# EAGLE schematic schematic_March16 (EAGLE 9.3.0)
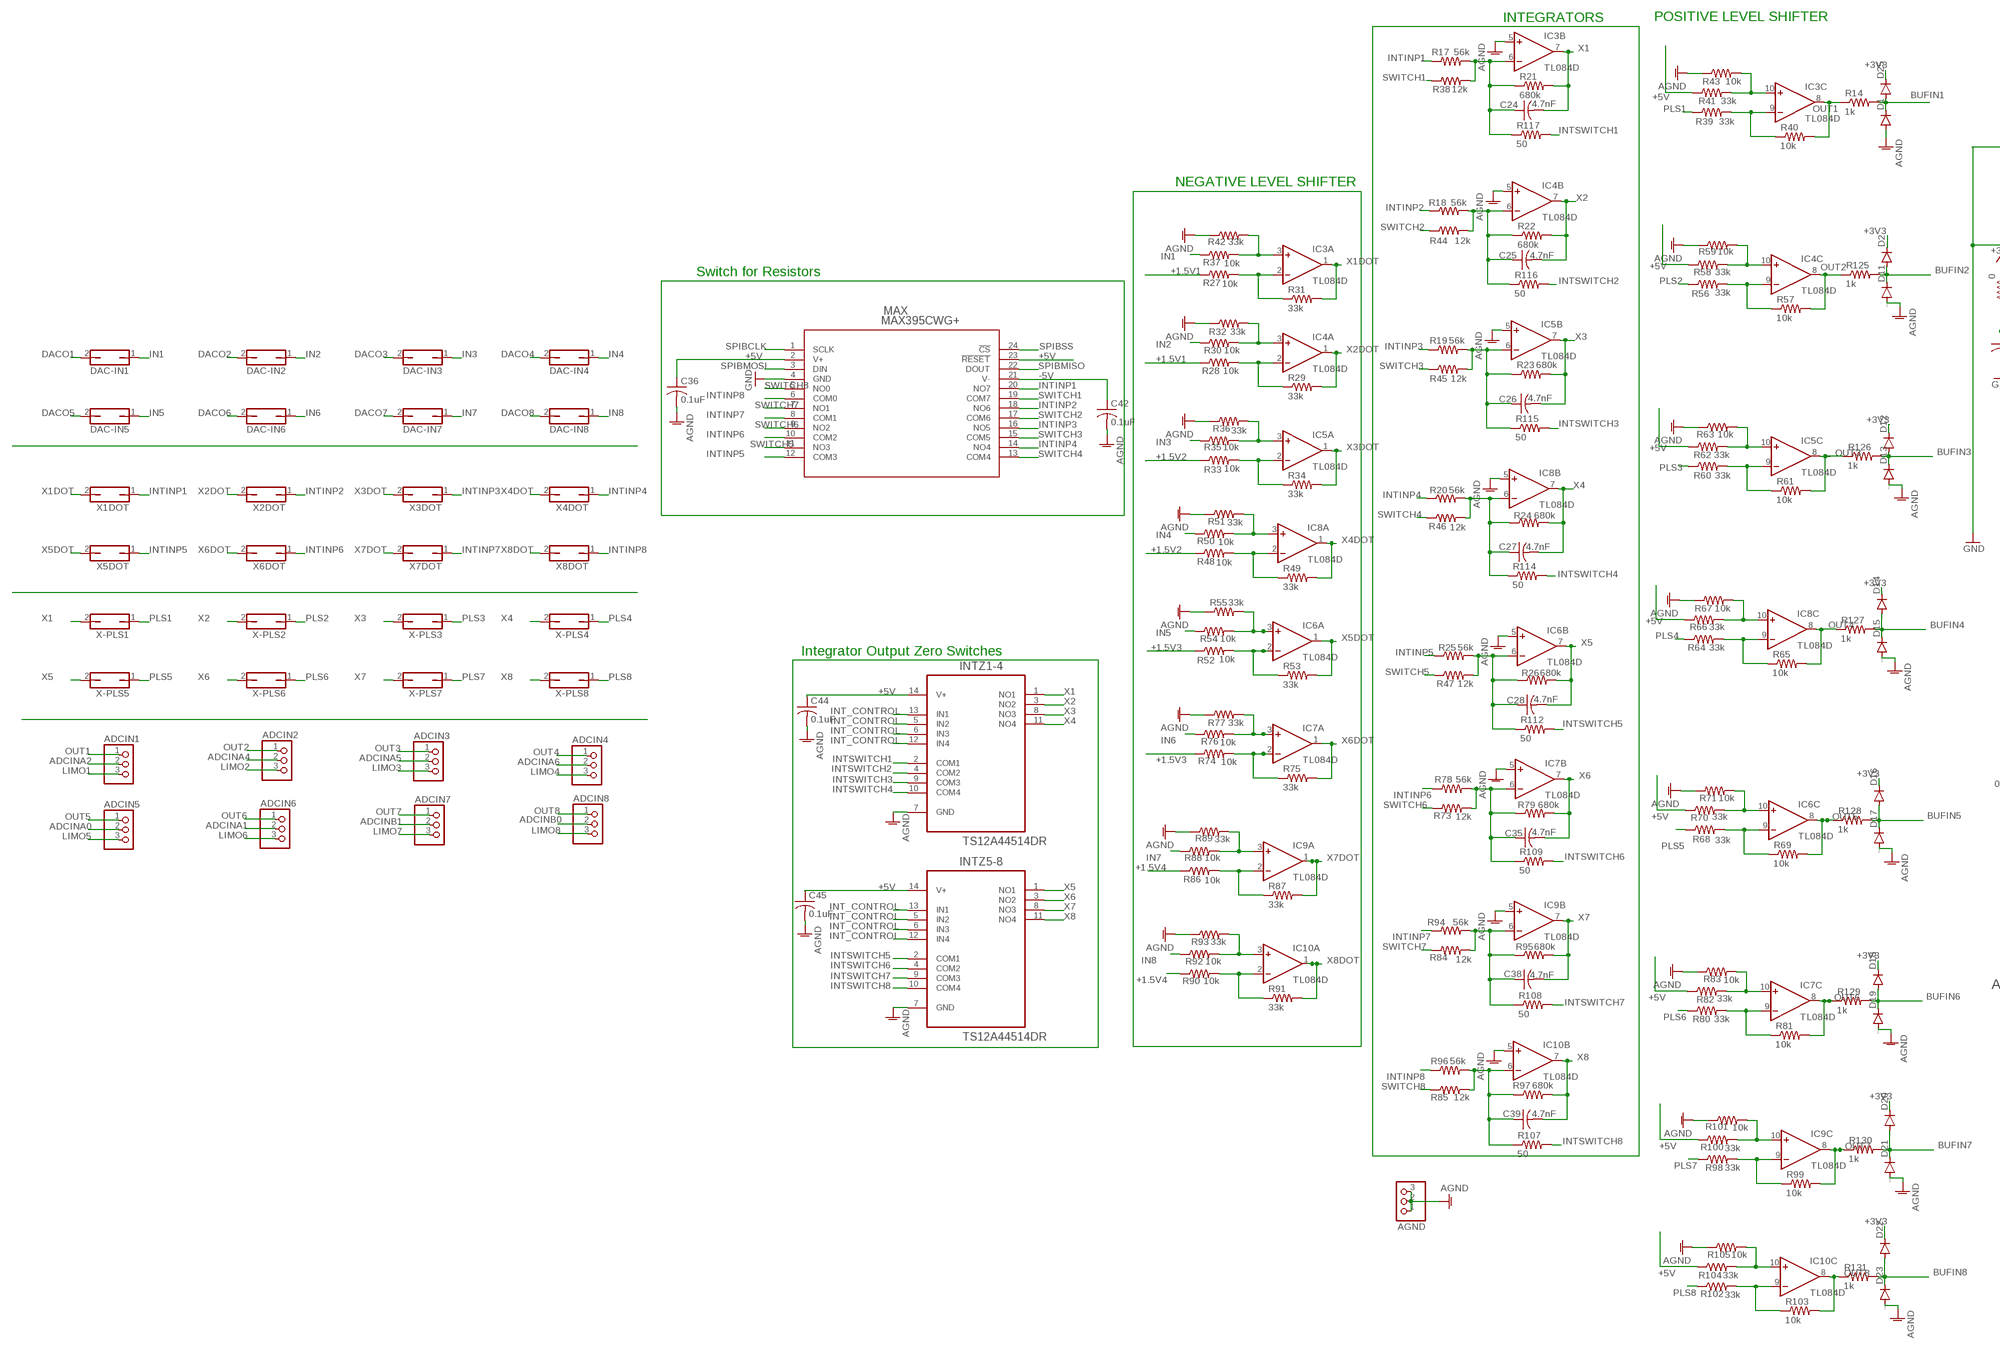
[diagram p0: schematic, sheet 1, part 1 of 2]
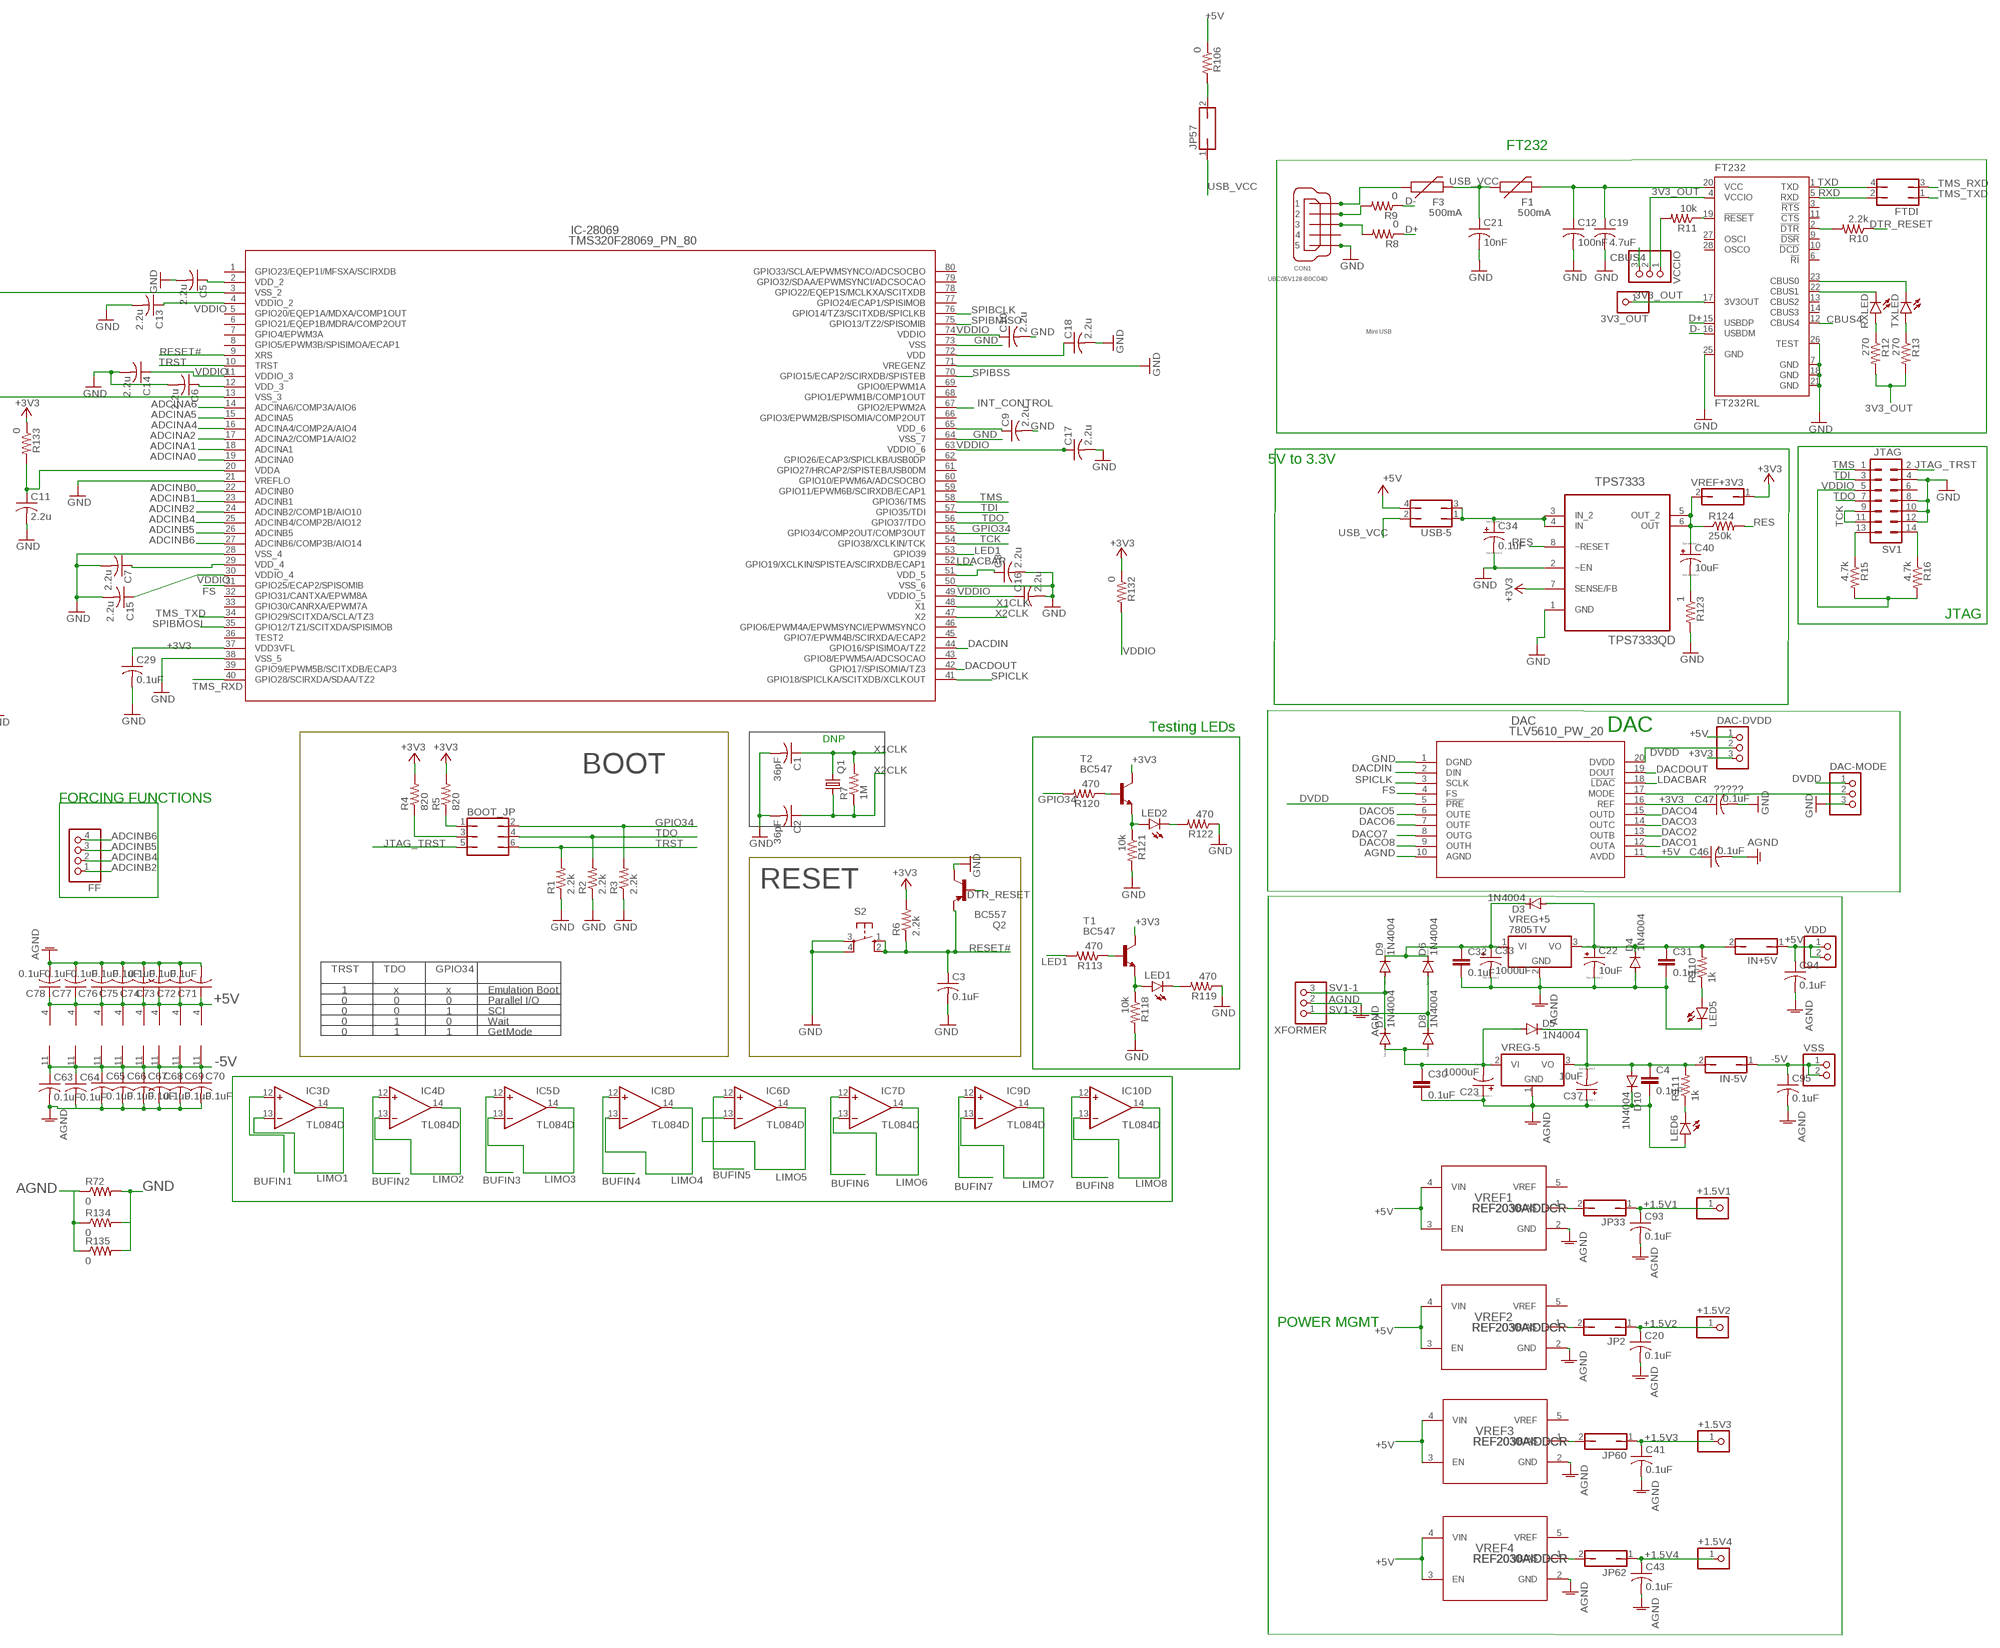
[diagram p1: schematic, sheet 1, part 2 of 2]

## Parts
3V3_OUT  PINHD-1X1  [1X01]
+1.5V1  PINHD-1X1  [1X01]
+1.5V2  PINHD-1X1  [1X01]
+1.5V3  PINHD-1X1  [1X01]
+1.5V4  PINHD-1X1  [1X01]
ADCIN1  PINHD-1X3  [1X03]
ADCIN2  PINHD-1X3  [1X03]
ADCIN3  PINHD-1X3  [1X03]
ADCIN4  PINHD-1X3  [1X03]
ADCIN5  PINHD-1X3  [1X03]
ADCIN6  PINHD-1X3  [1X03]
ADCIN7  PINHD-1X3  [1X03]
ADCIN8  PINHD-1X3  [1X03]
AGND  PINHD-1X3  [1X03]
BOOT_JP  JP3Q  [JP3Q]
C1  36pF  C-USC1206  [C1206]
C2  36pF  C-USC1206  [C1206]
C3  0.1uF  C-USC1206  [C1206]
C4  0.1uF  C-EUC1206  [C1206]
C5  2.2u  C-USC1206  [C1206]
C6  2.2u  C-USC1206  [C1206]
C7  2.2u  C-USC1206  [C1206]
C8  2.2u  C-USC1206  [C1206]
C9  2.2u  C-USC1206  [C1206]
C10  2.2u  C-USC1206  [C1206]
C11  2.2u  C-USC1206  [C1206]
C12  100nF  C-USC1206  [C1206]
C13  2.2u  C-USC1206  [C1206]
C14  2.2u  C-USC1206  [C1206]
C15  2.2u  C-USC1206  [C1206]
C16  2.2u  C-USC1206  [C1206]
C17  2.2u  C-USC1206  [C1206]
C18  2.2u  C-USC1206  [C1206]
C19  4.7uF  C-USC1206  [C1206]
C20  0.1uF  C-USC1206  [C1206]
C21  10nF  C-USC1206  [C1206]
C22  10uF  CPOL-USE2.5-7  [E2,5-7]
C23  1000uF  CPOL-USE2.5-7  [E2,5-7]
C24  4.7nF  C-USC1206  [C1206]
C25  4.7nF  C-USC1206  [C1206]
C26  4.7nF  C-USC1206  [C1206]
C27  4.7nF  C-USC1206  [C1206]
C28  4.7nF  C-USC1206  [C1206]
C29  0.1uF  C-USC1206  [C1206]
C30  0.1uF  C-EUC1206  [C1206]
C31  0.1uF  C-EUC1206  [C1206]
C32  0.1uF  C-EUC1206  [C1206]
C33  1000uF  CPOL-USE2.5-7  [E2,5-7]
C34  0.1uF  CPOL-USE2.5-7  [E2,5-7]
C35  4.7nF  C-USC1206  [C1206]
C36  0.1uF  C-USC1206  [C1206]
C37  10uF  CPOL-USE2.5-7  [E2,5-7]
C38  4.7nF  C-USC1206  [C1206]
C39  4.7nF  C-USC1206  [C1206]
C40  10uF  CPOL-USE2.5-7  [E2,5-7]
C41  0.1uF  C-USC1206  [C1206]
C42  0.1uF  C-USC1206  [C1206]
C43  0.1uF  C-USC1206  [C1206]
C44  0.1uF  C-USC1206  [C1206]
C45  0.1uF  C-USC1206  [C1206]
C46  0.1uF  C-USC1206  [C1206]
C47  0.1uF  C-USC1206  [C1206]
C63  0.1uF  C-USC1206  [C1206]
C64  0.1uF  C-USC1206  [C1206]
C65  0.1uF  C-USC1206  [C1206]
C66  0.1uF  C-USC1206  [C1206]
C67  0.1uF  C-USC1206  [C1206]
C68  0.1uF  C-USC1206  [C1206]
C69  0.1uF  C-USC1206  [C1206]
C70  0.1uF  C-USC1206  [C1206]
C71  0.1uF  C-USC1206  [C1206]
C72  0.1uF  C-USC1206  [C1206]
C73  0.1uF  C-USC1206  [C1206]
C74  0.1uF  C-USC1206  [C1206]
C75  0.1uF  C-USC1206  [C1206]
C76  0.1uF  C-USC1206  [C1206]
C77  0.1uF  C-USC1206  [C1206]
C78  0.1uF  C-USC1206  [C1206]
C93  0.1uF  C-USC1206  [C1206]
C94  0.1uF  C-USC1206  [C1206]
C95  0.1uF  C-USC1206  [C1206]
CON1  UBC05V128-B0C04D  MINI-USB-32005-201  [32005-201]
D1  DIODE-DO214AA  [DO214AA]
D2  DIODE-DO214AA  [DO214AA]
D3  1N4004  [DO41-10]
D4  1N4004  [DO41-10]
D5  1N4004  [DO41-10]
D6  1N4004  [DO41-10]
D7  1N4004  [DO41-10]
D8  1N4004  [DO41-10]
D9  1N4004  [DO41-10]
D10  1N4004  [DO41-10]
D11  DIODE-DO214AA  [DO214AA]
D12  DIODE-DO214AA  [DO214AA]
D13  DIODE-DO214AA  [DO214AA]
D14  DIODE-DO214AA  [DO214AA]
D15  DIODE-DO214AA  [DO214AA]
D16  DIODE-DO214AA  [DO214AA]
D17  DIODE-DO214AA  [DO214AA]
D18  DIODE-DO214AA  [DO214AA]
D19  DIODE-DO214AA  [DO214AA]
D20  DIODE-DO214AA  [DO214AA]
D21  DIODE-DO214AA  [DO214AA]
D22  DIODE-DO214AA  [DO214AA]
D23  DIODE-DO214AA  [DO214AA]
D25  DIODE-DO214AA  [DO214AA]
DAC  TLV5610_PW_20  [PW20]
DAC-DVDD  PINHD-1X3  [1X03]
DAC-IN1  JP1Q  [JP1]
DAC-IN2  JP1Q  [JP1]
DAC-IN3  JP1Q  [JP1]
DAC-IN4  JP1Q  [JP1]
DAC-IN5  JP1Q  [JP1]
DAC-IN6  JP1Q  [JP1]
DAC-IN7  JP1Q  [JP1]
DAC-IN8  JP1Q  [JP1]
DAC-MODE  PINHD-1X3  [1X03]
F1  500mA  PTC0603  [0603]
F3  500mA  PTC0603  [0603]
FF  PINHD-1X4  [1X04]
FT232  FT232RL  [SSOP28]
FTDI  JP2Q  [JP2Q]
IC3  TL084D  [SO14]
IC4  TL084D  [SO14]
IC5  TL084D  [SO14]
IC6  TL084D  [SO14]
IC7  TL084D  [SO14]
IC8  TL084D  [SO14]
IC9  TL084D  [SO14]
IC10  TL084D  [SO14]
IC-28069  TMS320F28069_PN_80  [PN80]
IN+5V  JP1Q  [JP1]
IN-5V  JP1Q  [JP1]
INTZ1-4  TS12A44514DR  [SOIC127P600X175-14N]
INTZ5-8  TS12A44514DR  [SOIC127P600X175-14N]
JP2  JP1Q  [JP1]
JP33  JP1Q  [JP1]
JP57  JP1Q  [JP1]
JP60  JP1Q  [JP1]
JP62  JP1Q  [JP1]
LED1  LEDSML1206  [SML1206]
LED2  LEDSML1206  [SML1206]
LED5  LEDSML1206  [SML1206]
LED6  LEDSML1206  [SML1206]
MAX  MAX395CWG+  [21-0042B_24]
Q1  CRYSTALHC49S  [HC49/S]
Q2  BC557  [TO92-EBC]
R1  2.2k  R-US_R1206  [R1206]
R2  2.2k  R-US_R1206  [R1206]
R3  2.2k  R-US_R1206  [R1206]
R4  820  R-US_R1206  [R1206]
R5  820  R-US_R1206  [R1206]
R6  2.2k  R-US_R1206  [R1206]
R7  1M  R-US_R1206  [R1206]
R8  0  R-US_R1206  [R1206]
R9  0  R-US_R1206  [R1206]
R10  2.2k  R-US_R1206  [R1206]
R11  10k  R-US_R1206  [R1206]
R12  270  R-US_R1206  [R1206]
R13  270  R-US_R1206  [R1206]
R14  1k  R-US_R1206  [R1206]
R15  4.7k  R-US_M1206  [M1206]
R16  4.7k  R-US_M1206  [M1206]
R17  56k  R-US_R1206  [R1206]
R18  56k  R-US_R1206  [R1206]
R19  56k  R-US_R1206  [R1206]
R20  56k  R-US_R1206  [R1206]
R21  680k  R-US_R1206  [R1206]
R22  680k  R-US_R1206  [R1206]
R23  680k  R-US_R1206  [R1206]
R24  680k  R-US_R1206  [R1206]
R25  56k  R-US_R1206  [R1206]
R26  680k  R-US_R1206  [R1206]
R27  10k  R-US_R1206  [R1206]
R28  10k  R-US_R1206  [R1206]
R29  33k  R-US_R1206  [R1206]
R30  10k  R-US_R1206  [R1206]
R31  33k  R-US_R1206  [R1206]
R32  33k  R-US_R1206  [R1206]
R33  10k  R-US_R1206  [R1206]
R34  33k  R-US_R1206  [R1206]
R35  10k  R-US_R1206  [R1206]
R36  33k  R-US_R1206  [R1206]
R37  10k  R-US_R1206  [R1206]
R38  12k  R-US_R1206  [R1206]
R39  33k  R-US_R1206  [R1206]
R40  10k  R-US_R1206  [R1206]
R41  33k  R-US_R1206  [R1206]
R42  33k  R-US_R1206  [R1206]
R43  10k  R-US_R1206  [R1206]
R44  12k  R-US_R1206  [R1206]
R45  12k  R-US_R1206  [R1206]
R46  12k  R-US_R1206  [R1206]
R47  12k  R-US_R1206  [R1206]
R48  10k  R-US_R1206  [R1206]
R49  33k  R-US_R1206  [R1206]
R50  10k  R-US_R1206  [R1206]
R51  33k  R-US_R1206  [R1206]
R52  10k  R-US_R1206  [R1206]
R53  33k  R-US_R1206  [R1206]
R54  10k  R-US_R1206  [R1206]
R55  33k  R-US_R1206  [R1206]
R56  33k  R-US_R1206  [R1206]
R57  10k  R-US_R1206  [R1206]
R58  33k  R-US_R1206  [R1206]
R59  10k  R-US_R1206  [R1206]
R60  33k  R-US_R1206  [R1206]
R61  10k  R-US_R1206  [R1206]
R62  33k  R-US_R1206  [R1206]
R63  10k  R-US_R1206  [R1206]
R64  33k  R-US_R1206  [R1206]
R65  10k  R-US_R1206  [R1206]
R66  33k  R-US_R1206  [R1206]
R67  10k  R-US_R1206  [R1206]
R68  33k  R-US_R1206  [R1206]
R69  10k  R-US_R1206  [R1206]
R70  33k  R-US_R1206  [R1206]
R71  10k  R-US_R1206  [R1206]
R72  0  R-US_R1206  [R1206]
R73  12k  R-US_R1206  [R1206]
R74  10k  R-US_R1206  [R1206]
R75  33k  R-US_R1206  [R1206]
R76  10k  R-US_R1206  [R1206]
R77  33k  R-US_R1206  [R1206]
R78  56k  R-US_R1206  [R1206]
R79  680k  R-US_R1206  [R1206]
R80  33k  R-US_R1206  [R1206]
R81  10k  R-US_R1206  [R1206]
R82  33k  R-US_R1206  [R1206]
R83  10k  R-US_R1206  [R1206]
R84  12k  R-US_R1206  [R1206]
R85  12k  R-US_R1206  [R1206]
R86  10k  R-US_R1206  [R1206]
R87  33k  R-US_R1206  [R1206]
R88  10k  R-US_R1206  [R1206]
R89  33k  R-US_R1206  [R1206]
R90  10k  R-US_R1206  [R1206]
R91  33k  R-US_R1206  [R1206]
R92  10k  R-US_R1206  [R1206]
R93  33k  R-US_R1206  [R1206]
R94  56k  R-US_R1206  [R1206]
R95  680k  R-US_R1206  [R1206]
R96  56k  R-US_R1206  [R1206]
R97  680k  R-US_R1206  [R1206]
R98  33k  R-US_R1206  [R1206]
R99  10k  R-US_R1206  [R1206]
R100  33k  R-US_R1206  [R1206]
R101  10k  R-US_R1206  [R1206]
R102  33k  R-US_R1206  [R1206]
R103  10k  R-US_R1206  [R1206]
R104  33k  R-US_R1206  [R1206]
R105  10k  R-US_R1206  [R1206]
R106  0  R-US_R1206  [R1206]
R107  50  R-US_R1206  [R1206]
R108  50  R-US_R1206  [R1206]
R109  50  R-US_R1206  [R1206]
R110  1k  R-US_0207/10  [0207/10]
R111  1k  R-US_0207/10  [0207/10]
R112  50  R-US_R1206  [R1206]
R113  470  R-US_R1206  [R1206]
R114  50  R-US_R1206  [R1206]
R115  50  R-US_R1206  [R1206]
R116  50  R-US_R1206  [R1206]
R117  50  R-US_R1206  [R1206]
R118  10k  R-US_R1206  [R1206]
R119  470  R-US_R1206  [R1206]
R120  470  R-US_R1206  [R1206]
R121  10k  R-US_R1206  [R1206]
R122  470  R-US_R1206  [R1206]
R123  1  R-US_M1206  [M1206]
R124  250k  R-US_M1206  [M1206]
R125  1k  R-US_R1206  [R1206]
R126  1k  R-US_R1206  [R1206]
R127  1k  R-US_R1206  [R1206]
R128  1k  R-US_R1206  [R1206]
R129  1k  R-US_R1206  [R1206]
R130  1k  R-US_R1206  [R1206]
R131  1k  R-US_R1206  [R1206]
R132  0  R-US_R1206  [R1206]
R133  0  R-US_R1206  [R1206]
R134  0  R-US_R1206  [R1206]
R135  0  R-US_R1206  [R1206]
RXLED  LEDSML1206  [SML1206]
S2  10-XX  [B3F-10XX]
SV1  JTAG  MA07-2  [MA07-2]
T1  BC547  [TO92]
T2  BC547  [TO92]
TPS7333  TPS7333QD  [SOIC127P600X175-8N]
TXLED  LEDSML1206  [SML1206]
USB-5  JP2Q  [JP2Q]
VCCIO  PINHD-1X3  [1X03]
VDD  PINHD-1X2  [1X02]
VREF1  REF2030AIDDCR  [DDC0005A_N]
VREF2  REF2030AIDDCR  [DDC0005A_N]
VREF3  REF2030AIDDCR  [DDC0005A_N]
VREF4  REF2030AIDDCR  [DDC0005A_N]
VREF+3V3  JP1Q  [JP1]
VREG+5  7805TV  [TO220V]
VREG-5  7905T  [TO220H]
VSS  PINHD-1X2  [1X02]
X1DOT  JP1Q  [JP1]
X2DOT  JP1Q  [JP1]
X3DOT  JP1Q  [JP1]
X4DOT  JP1Q  [JP1]
X5DOT  JP1Q  [JP1]
X6DOT  JP1Q  [JP1]
X7DOT  JP1Q  [JP1]
X8DOT  JP1Q  [JP1]
X-PLS1  JP1Q  [JP1]
X-PLS2  JP1Q  [JP1]
X-PLS3  JP1Q  [JP1]
X-PLS4  JP1Q  [JP1]
X-PLS5  JP1Q  [JP1]
X-PLS6  JP1Q  [JP1]
X-PLS7  JP1Q  [JP1]
X-PLS8  JP1Q  [JP1]
XFORMER  PINHD-1X3  [1X03]

## Nets
3V3_OUT: 3V3_OUT.1 FT232.4(VCCIO) FT232.17(3V3OUT) R12.2 R13.2 VCCIO.2
+1.5V1: +1.5V1.1 C93.1 JP33.1 R27.1 R28.1
+1.5V2: +1.5V2.1 C20.1 JP2.1 R33.1 R48.1
+1.5V3: +1.5V3.1 C41.1 JP60.1 R52.1 R74.1
+1.5V4: +1.5V4.1 C43.1 JP62.1 R86.1 R90.1
+3V3: C29.1 C47.1 D2.C D12.C D14.C D16.C D18.C D20.C D22.C D25.C DAC-DVDD.3 DAC.16(REF) IC-28069.37(VDD3VFL) R4.2 R5.2 R6.2 R132.1 R133.1 T1.3(C) T2.3(C) TPS7333.7(SENSE/FB) VREF+3V3.1
+5V: C36.1 C44.1 C45.1 C46.1 C71.1 C72.1 C73.1 C74.1 C75.1 C76.1 C77.1 C78.1 C94.1 DAC-DVDD.1 DAC.11(AVDD) IC3.4(P:V+) IC4.4(P:V+) IC5.4(P:V+) IC6.4(P:V+) IC7.4(P:V+) IC8.4(P:V+) IC9.4(P:V+) IC10.4(P:V+) IN+5V.1 INTZ1-4.14(V+) INTZ5-8.14(V+) MAX.2(V+) MAX.23(!RESET) R41.1 R58.1 R62.1 R66.1 R70.1 R82.1 R100.1 R104.1 R106.1 USB-5.4 VDD.1 VDD.2 VREF1.3(EN) VREF1.4(VIN) VREF2.3(EN) VREF2.4(VIN) VREF3.3(EN) VREF3.4(VIN) VREF4.3(EN) VREF4.4(VIN) ; supply symbol labelled +3V3
-5V: C42.1 C63.1 C64.1 C65.1 C66.1 C67.1 C68.1 C69.1 C70.1 C95.1 IC3.11(P:V-) IC4.11(P:V-) IC5.11(P:V-) IC6.11(P:V-) IC7.11(P:V-) IC8.11(P:V-) IC9.11(P:V-) IC10.11(P:V-) IN-5V.1 MAX.21(V-) VSS.1 VSS.2
?????: DAC-MODE.2 DAC.17(MODE)
ADCINA0: ADCIN5.2 IC-28069.19(ADCINA0)
ADCINA1: ADCIN6.2 IC-28069.18(ADCINA1)
ADCINA2: ADCIN1.2 IC-28069.17(ADCINA2/COMP1A/AIO2)
ADCINA4: ADCIN2.2 IC-28069.16(ADCINA4/COMP2A/AIO4)
ADCINA5: ADCIN3.2 IC-28069.15(ADCINA5)
ADCINA6: ADCIN4.2 IC-28069.14(ADCINA6/COMP3A/AIO6)
ADCINB0: ADCIN8.2 IC-28069.22(ADCINB0)
ADCINB1: ADCIN7.2 IC-28069.23(ADCINB1)
ADCINB2: FF.1 IC-28069.24(ADCINB2/COMP1B/AIO10)
ADCINB4: FF.2 IC-28069.25(ADCINB4/COMP2B/AIO12)
ADCINB5: FF.3 IC-28069.26(ADCINB5)
ADCINB6: FF.4 IC-28069.27(ADCINB6/COMP3B/AIO14)
AGND: AGND.1 AGND.2 AGND.3 C4.2 C20.2 C22.- C23.+ C30.2 C31.2 C32.2 C33.- C36.2 C37.+ C41.2 C42.2 C43.2 C44.2 C45.2 C46.2 C63.2 C64.2 C65.2 C66.2 C67.2 C68.2 C69.2 C70.2 C71.2 C72.2 C73.2 C74.2 C75.2 C76.2 C77.2 C78.2 C93.2 C94.2 C95.2 D1.A D4.A D10.C D11.A D13.A D15.A D17.A D19.A D21.A D23.A DAC.10(AGND) IC3.5(B:+IN) IC4.5(B:+IN) IC5.5(B:+IN) IC6.5(B:+IN) IC7.5(B:+IN) IC8.5(B:+IN) IC9.5(B:+IN) IC10.5(B:+IN) INTZ1-4.7(GND) INTZ5-8.7(GND) LED5.C LED6.A R32.1 R36.1 R42.1 R43.1 R51.1 R55.1 R59.1 R63.1 R67.1 R71.1 R72.1 R77.1 R83.1 R89.1 R93.1 R101.1 R105.1 R134.1 R135.1 VREF1.2(GND) VREF2.2(GND) VREF3.2(GND) VREF4.2(GND) VREG+5.2(GND) VREG-5.1(GND) XFORMER.2
BUFIN1: D1.C D25.A IC3.12(D:+IN) R14.2
BUFIN2: D2.A D11.C IC4.12(D:+IN) R125.2
BUFIN3: D12.A D13.C IC5.12(D:+IN) R126.2
BUFIN4: D14.A D15.C IC8.12(D:+IN) R127.2
BUFIN5: D16.A D17.C IC6.12(D:+IN) R128.2
BUFIN6: D18.A D19.C IC7.12(D:+IN) R129.2
BUFIN7: D20.A D21.C IC9.12(D:+IN) R130.2
BUFIN8: D22.A D23.C IC10.12(D:+IN) R131.2
CBUS4: FT232.12(CBUS4) VCCIO.3
D+: FT232.15(USBDP) R8.1
D-: FT232.16(USBDM) R9.1
DACDIN: DAC.2(DIN) IC-28069.44(GPIO16/SPISIMOA/TZ2)
DACDOUT: DAC.19(DOUT) IC-28069.42(GPIO17/SPISOMIA/TZ3)
DACO1: DAC-IN1.2 DAC.12(OUTA)
DACO2: DAC-IN2.2 DAC.13(OUTB)
DACO3: DAC-IN3.2 DAC.14(OUTC)
DACO4: DAC-IN4.2 DAC.15(OUTD)
DACO5: DAC-IN5.2 DAC.6(OUTE)
DACO6: DAC-IN6.2 DAC.7(OUTF)
DACO7: DAC-IN7.2 DAC.8(OUTG)
DACO8: DAC-IN8.2 DAC.9(OUTH)
DTR_RESET: Q2.B R10.1
DVDD: DAC-DVDD.2 DAC-MODE.1 DAC.5(!PRE) DAC.20(DVDD)
FS: DAC.4(FS) IC-28069.31(GPIO25/ECAP2/SPISOMIB)
GND: C1.2 C2.2 C3.2 C5.2 C6.2 C7.2 C8.2 C9.2 C10.2 C11.2 C12.2 C13.2 C14.2 C15.2 C16.2 C17.2 C18.2 C19.2 C21.2 C29.2 C34.- C47.2 CON1.5 DAC-MODE.3 DAC.1(DGND) FT232.7(GND) FT232.18(GND) FT232.21(GND) FT232.25(GND) FT232.26(TEST) IC-28069.3(VSS_2) IC-28069.13(VSS_3) IC-28069.21(VREFLO) IC-28069.28(VSS_4) IC-28069.38(VSS_5) IC-28069.50(VSS_6) IC-28069.64(VSS_7) IC-28069.71(VREGENZ) IC-28069.73(VSS) MAX.4(GND) Q2.C R1.1 R2.1 R3.1 R72.2 R118.2 R119.1 R121.2 R122.1 R123.2 R134.2 R135.2 S2.3(P) S2.4(P1) SV1.4 SV1.8 SV1.10 SV1.12 TPS7333.1(GND) TPS7333.2(~EN)
GPIO34: BOOT_JP.2 IC-28069.55(GPIO34/COMP2OUT/COMP3OUT) R3.2 R120.2
IDK: C22.+ C31.1 D3.A D4.C IN+5V.2 R110.2 VREG+5.3(VO)
IDK2: C4.1 C37.- D5.C D10.A IN-5V.2 R111.2 VREG-5.3(VO)
IN1: DAC-IN1.1 R37.1
IN2: DAC-IN2.1 R30.1
IN3: DAC-IN3.1 R35.1
IN4: DAC-IN4.1 R50.1
IN5: DAC-IN5.1 R54.1
IN6: DAC-IN6.1 R76.1
IN7: DAC-IN7.1 R88.1
IN8: DAC-IN8.1 R92.1
INT_CONTROL: IC-28069.67(GPIO2/EPWM2A) INTZ1-4.5(IN2) INTZ1-4.6(IN3) INTZ1-4.12(IN4) INTZ1-4.13(IN1) INTZ5-8.5(IN2) INTZ5-8.6(IN3) INTZ5-8.12(IN4) INTZ5-8.13(IN1)
INTINP1: MAX.20(NO7) R17.1 X1DOT.1
INTINP2: MAX.18(NO6) R18.1 X2DOT.1
INTINP3: MAX.16(NO5) R19.1 X3DOT.1
INTINP4: MAX.14(NO4) R20.1 X4DOT.1
INTINP5: MAX.12(COM3) R25.1 X5DOT.1
INTINP6: MAX.10(COM2) R78.1 X6DOT.1
INTINP7: MAX.8(COM1) R94.1 X7DOT.1
INTINP8: MAX.6(COM0) R96.1 X8DOT.1
INTSWITCH1: INTZ1-4.2(COM1) R117.2
INTSWITCH2: INTZ1-4.4(COM2) R116.2
INTSWITCH3: INTZ1-4.9(COM3) R115.2
INTSWITCH4: INTZ1-4.10(COM4) R114.2
INTSWITCH5: INTZ5-8.2(COM1) R112.2
INTSWITCH6: INTZ5-8.4(COM2) R109.2
INTSWITCH7: INTZ5-8.9(COM3) R108.2
INTSWITCH8: INTZ5-8.10(COM4) R107.2
JTAG_TRST: BOOT_JP.5 SV1.2
LDACBAR: DAC.18(!LDAC) IC-28069.52(GPIO19/XCLKIN/SPISTEA/SCIRXDB/ECAP1)
LED1: IC-28069.53(GPIO39) R113.2
LIMO1: ADCIN1.3 IC3.13(D:-IN) IC3.14(D:OUT)
LIMO2: ADCIN2.3 IC4.13(D:-IN) IC4.14(D:OUT)
LIMO3: ADCIN3.3 IC5.13(D:-IN) IC5.14(D:OUT)
LIMO4: ADCIN4.3 IC8.13(D:-IN) IC8.14(D:OUT)
LIMO5: ADCIN5.3 IC6.13(D:-IN) IC6.14(D:OUT)
LIMO6: ADCIN6.3 IC7.13(D:-IN) IC7.14(D:OUT)
LIMO7: ADCIN7.3 IC9.13(D:-IN) IC9.14(D:OUT)
LIMO8: ADCIN8.3 IC10.13(D:-IN) IC10.14(D:OUT)
N$1: C5.1 IC-28069.2(VDD_2)
N$2: C6.1 IC-28069.12(VDD_3)
N$3: C7.1 IC-28069.29(VDD_4)
N$4: C8.1 IC-28069.51(VDD_5)
N$5: C9.1 IC-28069.65(VDD_6)
N$6: FT232.2(!DTR) R10.2
N$7: C11.1 IC-28069.20(VDDA) R133.2
N$8: C18.1 IC-28069.72(VDD)
N$9: BOOT_JP.1 R5.1
N$10: BOOT_JP.3 R4.1
N$11: CON1.2 R9.2
N$12: CON1.3 R8.2
N$13: FT232.19(!RESET) R11.1
N$14: FT232.22(CBUS1) RXLED.C
N$15: FT232.23(CBUS0) TXLED.C
N$16: R12.1 RXLED.A
N$17: R13.1 TXLED.A
N$20: C25.1 IC4.6(B:-IN) R18.2 R22.1 R44.2 R116.1
N$21: C26.1 IC5.6(B:-IN) R19.2 R23.1 R45.2 R115.1
N$22: C27.1 IC8.6(B:-IN) R20.2 R24.1 R46.2 R114.1
N$23: IC4.2(A:-IN) R28.2 R29.1
N$24: R15.1 SV1.13
N$25: R16.1 SV1.14
N$26: IC4.3(A:+IN) R30.2 R32.2
N$28: C24.1 IC3.6(B:-IN) R17.2 R21.1 R38.2 R117.1
N$29: IC3.2(A:-IN) R27.2 R31.1
N$30: C28.1 IC6.6(B:-IN) R25.2 R26.1 R47.2 R112.1
N$31: IC5.2(A:-IN) R33.2 R34.1
N$33: IC3.3(A:+IN) R37.2 R42.2
N$35: IC5.3(A:+IN) R35.2 R36.2
N$36: IC3.9(C:-IN) R39.2 R40.1
N$38: IC3.10(C:+IN) R41.2 R43.2
N$39: IC8.2(A:-IN) R48.2 R49.1
N$40: IC8.3(A:+IN) R50.2 R51.2
N$41: IC7.2(A:-IN) R74.2 R75.1
N$42: IC6.2(A:-IN) R52.2 R53.1
N$44: IC6.3(A:+IN) R54.2 R55.2
N$45: IC7.3(A:+IN) R76.2 R77.2
N$47: IC4.9(C:-IN) R56.2 R57.1
N$48: IC4.10(C:+IN) R58.2 R59.2
N$49: IC5.9(C:-IN) R60.2 R61.1
N$50: IC5.10(C:+IN) R62.2 R63.2
N$51: IC8.9(C:-IN) R64.2 R65.1
N$52: IC8.10(C:+IN) R66.2 R67.2
N$53: IC6.9(C:-IN) R68.2 R69.1
N$54: IC6.10(C:+IN) R70.2 R71.2
N$55: C35.1 IC7.6(B:-IN) R73.2 R78.2 R79.1 R109.1
N$56: IC7.9(C:-IN) R80.2 R81.1
N$57: IC7.10(C:+IN) R82.2 R83.2
N$58: IC9.2(A:-IN) R86.2 R87.1
N$59: IC9.3(A:+IN) R88.2 R89.2
N$60: IC10.2(A:-IN) R90.2 R91.1
N$61: IC10.3(A:+IN) R92.2 R93.2
N$62: C38.1 IC9.6(B:-IN) R84.2 R94.2 R95.1 R108.1
N$63: C39.1 IC10.6(B:-IN) R85.2 R96.2 R97.1 R107.1
N$64: IC9.9(C:-IN) R98.2 R99.1
N$65: IC9.10(C:+IN) R100.2 R101.2
N$66: IC10.9(C:-IN) R102.2 R103.1
N$67: IC10.10(C:+IN) R104.2 R105.2
N$73: C32.1 C33.+ D3.C D6.C D9.C VREG+5.1(VI)
N$77: C40.+ R124.1 TPS7333.5(OUT_2) TPS7333.6(OUT) VREF+3V3.2
N$78: C40.- R123.1
N$80: LED6.C R111.1
N$81: C34.+ TPS7333.3(IN_2) TPS7333.4(IN) USB-5.1 USB-5.3
N$82: LED5.A R110.1
N$83: CON1.1 F3.1
N$86: C23.- C30.1 D5.A D7.A D8.A VREG-5.2(VI)
N$91: JP33.2 VREF1.1(VBIAS)
N$95: R11.2 VCCIO.1
N$102: R113.1 T1.2(B)
N$104: LED1.A R118.1 T1.1(E)
N$105: LED1.C R119.2
N$106: R120.1 T2.2(B)
N$107: LED2.A R121.1 T2.1(E)
N$108: LED2.C R122.2
N$132: JP2.2 VREF2.1(VBIAS)
N$134: JP57.2 R106.2
N$135: JP60.2 VREF3.1(VBIAS)
N$136: JP62.2 VREF4.1(VBIAS)
OUT1: ADCIN1.1 IC3.8(C:OUT) R14.1 R40.2
OUT2: ADCIN2.1 IC4.8(C:OUT) R57.2 R125.1
OUT3: ADCIN3.1 IC5.8(C:OUT) R61.2 R126.1
OUT4: ADCIN4.1 IC8.8(C:OUT) R65.2 R127.1
OUT5: ADCIN5.1 IC6.8(C:OUT) R69.2 R128.1
OUT6: ADCIN6.1 IC7.8(C:OUT) R81.2 R129.1
OUT7: ADCIN7.1 IC9.8(C:OUT) R99.2 R130.1
OUT8: ADCIN8.1 IC10.8(C:OUT) R103.2 R131.1
PLS1: R39.1 X-PLS1.1
PLS2: R56.1 X-PLS2.1
PLS3: R60.1 X-PLS3.1
PLS4: R64.1 X-PLS4.1
PLS5: R68.1 X-PLS5.1
PLS6: R80.1 X-PLS6.1
PLS7: R98.1 X-PLS7.1
PLS8: R102.1 X-PLS8.1
RES: R124.2 TPS7333.8(~RESET)
RESET#: C3.1 IC-28069.9(XRS) Q2.E R6.1 S2.1(S) S2.2(S1)
RXD: FT232.5(RXD) FTDI.2
SPIBCLK: IC-28069.76(GPIO14/TZ3/SCITXDB/SPICLKB) MAX.1(SCLK)
SPIBMISO: IC-28069.75(GPIO13/TZ2/SPISOMIB) MAX.22(DOUT)
SPIBMOSI: IC-28069.35(GPIO12/TZ1/SCITXDA/SPISIMOB) MAX.3(DIN)
SPIBSS: IC-28069.70(GPIO15/ECAP2/SCIRXDB/SPISTEB) MAX.24(!CS)
SPICLK: DAC.3(SCLK) IC-28069.41(GPIO18/SPICLKA/SCITXDB/XCLKOUT)
SV1-1: D7.C D9.A XFORMER.3
SV1-3: D6.A D8.C XFORMER.1
SWITCH1: MAX.19(COM7) R38.1
SWITCH2: MAX.17(COM6) R44.1
SWITCH3: MAX.15(COM5) R45.1
SWITCH4: MAX.13(COM4) R46.1
SWITCH5: MAX.11(NO3) R47.1
SWITCH6: MAX.9(NO2) R73.1
SWITCH7: MAX.7(NO1) R84.1
SWITCH8: MAX.5(NO0) R85.1
TCK: IC-28069.54(GPIO38/XCLKIN/TCK) SV1.9 SV1.11
TDI: IC-28069.57(GPIO35/TDI) SV1.3
TDO: BOOT_JP.4 IC-28069.56(GPIO37/TDO) R2.2 SV1.7
TMS: IC-28069.58(GPIO36/TMS) SV1.1
TMS_RXD: FTDI.3 IC-28069.40(GPIO28/SCIRXDA/SDAA/TZ2)
TMS_TXD: FTDI.1 IC-28069.34(GPIO29/SCITXDA/SCLA/TZ3)
TRST: BOOT_JP.6 IC-28069.10(TRST) R1.2
TXD: FT232.1(TXD) FTDI.4
USB_VCC: C21.1 F1.1 F3.2 JP57.1 USB-5.2
VCC [power]: C12.1 C19.1 F1.2 FT232.20(VCC)
VDDIO: C10.1 C13.1 C14.1 C15.1 C16.1 C17.1 IC-28069.4(VDDIO_2) IC-28069.11(VDDIO_3) IC-28069.30(VDDIO_4) IC-28069.49(VDDIO_5) IC-28069.63(VDDIO_6) IC-28069.74(VDDIO) R15.2 R16.2 R132.2 SV1.5
X1: C24.2 IC3.7(B:OUT) INTZ1-4.1(NO1) R21.2 X-PLS1.2
X1CLK: C1.1 IC-28069.48(X1) Q1.2 R7.2
X1DOT: IC3.1(A:OUT) R31.2 X1DOT.2
X2: C25.2 IC4.7(B:OUT) INTZ1-4.3(NO2) R22.2 X-PLS2.2
X2CLK: C2.1 IC-28069.47(X2) Q1.1 R7.1
X2DOT: IC4.1(A:OUT) R29.2 X2DOT.2
X3: C26.2 IC5.7(B:OUT) INTZ1-4.8(NO3) R23.2 X-PLS3.2
X3DOT: IC5.1(A:OUT) R34.2 X3DOT.2
X4: C27.2 IC8.7(B:OUT) INTZ1-4.11(NO4) R24.2 X-PLS4.2
X4DOT: IC8.1(A:OUT) R49.2 X4DOT.2
X5: C28.2 IC6.7(B:OUT) INTZ5-8.1(NO1) R26.2 X-PLS5.2
X5DOT: IC6.1(A:OUT) R53.2 X5DOT.2
X6: C35.2 IC7.7(B:OUT) INTZ5-8.3(NO2) R79.2 X-PLS6.2
X6DOT: IC7.1(A:OUT) R75.2 X6DOT.2
X7: C38.2 IC9.7(B:OUT) INTZ5-8.8(NO3) R95.2 X-PLS7.2
X7DOT: IC9.1(A:OUT) R87.2 X7DOT.2
X8: C39.2 IC10.7(B:OUT) INTZ5-8.11(NO4) R97.2 X-PLS8.2
X8DOT: IC10.1(A:OUT) R91.2 X8DOT.2
Unconnected: CON1.4 FT232.3(!RTS) FT232.6(!RI) FT232.9(!DSR) FT232.10(!DCD) FT232.11(!CTS) FT232.13(CBUS2) FT232.14(CBUS3) FT232.27(OSCI) FT232.28(OSCO) IC-28069.1(GPIO23/EQEP1I/MFSXA/SCIRXDB) IC-28069.5(GPIO20/EQEP1A/MDXA/COMP1OUT) IC-28069.6(GPIO21/EQEP1B/MDRA/COMP2OUT) IC-28069.7(GPIO4/EPWM3A) IC-28069.8(GPIO5/EPWM3B/SPISIMOA/ECAP1) IC-28069.32(GPIO31/CANTXA/EPWM8A) IC-28069.33(GPIO30/CANRXA/EPWM7A) IC-28069.36(TEST2) IC-28069.39(GPIO9/EPWM5B/SCITXDB/ECAP3) IC-28069.43(GPIO8/EPWM5A/ADCSOCAO) IC-28069.45(GPIO7/EPWM4B/SCIRXDA/ECAP2) IC-28069.46(GPIO6/EPWM4A/EPWMSYNCI/EPWMSYNCO) IC-28069.59(GPIO11/EPWM6B/SCIRXDB/ECAP1) IC-28069.60(GPIO10/EPWM6A/ADCSOCBO) IC-28069.61(GPIO27/HRCAP2/SPISTEB/USB0DM) IC-28069.62(GPIO26/ECAP3/SPICLKB/USB0DP) IC-28069.66(GPIO3/EPWM2B/SPISOMIA/COMP2OUT) IC-28069.68(GPIO1/EPWM1B/COMP1OUT) IC-28069.69(GPIO0/EPWM1A) IC-28069.77(GPIO24/ECAP1/SPISIMOB) IC-28069.78(GPIO22/EQEP1S/MCLKXA/SCITXDB) IC-28069.79(GPIO32/SDAA/EPWMSYNCI/ADCSOCAO) IC-28069.80(GPIO33/SCLA/EPWMSYNCO/ADCSOCBO) SV1.6 VREF1.5(VREF) VREF2.5(VREF) VREF3.5(VREF) VREF4.5(VREF)

## Notes on the sheet
- FT232
- INTEGRATORS | POSITIVE LEVEL SHIFTER
- NEGATIVE LEVEL SHIFTER | Mini USB
- Switch for Resistors
- 5V to 3.3V
- JTAG
- Testing LEDs | DAC
- DNP
- BOOT
- FORCING FUNCTIONS
- Integrator Output Zero Switches
- RESET
- TRST | TDO | GPIO34
- 1 | x | x | Emulation Boot
- 0 | 0 | 0 | Parallel I/O
- 0 | 0 | 1 | SCI
- 0 | 1 | 0 | Wait
- 0 | 1 | 1 | GetMode
- POWER MGMT

## Library data of the parts
3V3_OUT +1.5V1-+1.5V4 = pinhead:PINHD-1X1: PIN HEADER
ADCIN1-ADCIN8 AGND DAC-DVDD DAC-MODE VCCIO XFORMER = pinhead:PINHD-1X3: PIN HEADER
BOOT_JP = jumper:JP3Q: JUMPER
C1-C3 C5-C21 C29 C36 C41-C45 C63-C78 C93-C95 = resistor:C-US: CAPACITOR, American symbol
C4 C30-C32 = rcl:C-EU: CAPACITOR, European symbol; SPICEPREFIX: C
C22 C23 C33 C34 C37 C40 = resistor:CPOL-US: POLARIZED CAPACITOR, American symbol
C24-C28 C35 C38 C39 C46 C47 = rcl:C-US: CAPACITOR, American symbol; SPICEPREFIX: C
CON1 = con-cypressindustries:MINI-USB-: MINI USB-B Conector Source: www.cypressindustries.com; OC_FARNELL: unknown; OC_NEWARK: unknown
D1 D2 D11-D23 D25 = diode:DIODE-: DIODE
D3-D10 = diode:1N4004: DIODE general purpose rectifier, 1 A
DAC = TLV5610:TLV5610_PW_20; MANUFACTURER_PART_NUMBER: tlv5610_pw_20; VENDOR: Texas Instruments
DAC-IN1-DAC-IN8 IN+5V IN-5V JP2 JP33 JP57 JP60 JP62 VREF+3V3 X1DOT X2DOT X3DOT X4DOT X5DOT X6DOT X7DOT X8DOT X-PLS1-X-PLS8 = jumper:JP1Q: JUMPER
F1 F3 = SparkFun:PTC: Resettable Fuse PTC Resettable Fuse. Spark Fun Electronics SKU : COM-08357
FF = pinhead:PINHD-1X4: PIN HEADER
FT232 = ftdichip:FT232R: Source: http://www.ftdichip.com/Documents/DataSheets/DS_FT232R_v104.pdf; MPN: FT232RL; OC_FARNELL: 1146032; OC_NEWARK: 91K9918
FTDI USB-5 = jumper:JP2Q: JUMPER
IC3-IC10 = linear:TL084: OP AMP
IC-28069 = uP:TMS320F28069_PN_80; MANUFACTURER_PART_NUMBER: tms320f28069_pn_80; VENDOR: Texas Instruments
INTZ1-4 INTZ5-8 = Texas Instruments_By_element14_Batch_1:TS12A44514DR: QUAD SPST CMOS ANALOG SWITCHES; MPN: TS12A44514DR; OC_FARNELL: 1755398; OC_NEWARK: 95M0176; PACKAGE: SOIC-14; SUPPLIER: Texas Instruments
LED1 LED2 LED5 LED6 RXLED TXLED = led:LED: LED OSRAM: - CHIPLED LG R971, LG N971, LY N971, LG Q971, LY Q971, LO R971, LY R971 LH N974, LH R974 LS Q976, LO Q976, LY Q976 LO Q996 - Hyper CHIPLED LW Q18S LB Q993, LB Q99A, LB R99A - SideLED LS A670, LO A670, LY A670, LG A670, LP A670 LB A673, LV A673, LT A673, LW A673 LH A674 LY A675 LS A676, LA A676, LO A676, LY A676, LW A676 LS A679, LY A679, LG A679 - Hyper Micro SIDELED® LS Y876, LA Y876, LO Y876, LY Y876 LT Y87S - SmartLED LW L88C, LW L88S LB L89C, LB L89S, LG L890 LS L89K, LO L89K, LY L89K LS L896, LA L896, LO L896, LY L896 - TOPLED LS T670, LO T670, LY T670, LG T670, LP T670 LSG T670, LSP T670, LSY T670, LOP T670, LYG T670 LG T671, LOG T671, LSG T671 LB T673, LV T673, LT T673, LW T673 LH T674 LS T676, LA T676, LO T676, LY T676, LB T676, LH T676, LSB T676, LW T676 LB T67C, LV T67C, LT T67C, LS T67K, LO T67K, LY T67K, LW E67C LS E67B, LA E67B, LO E67B, LY E67B, LB E67C, LV E67C, LT E67C LW T67C LS T679, LY T679, LG T679 LS T770, LO T770, LY T770, LG T770, LP T770 LB T773, LV T773, LT T773, LW T773 LH T774 LS E675, LA E675, LY E675, LS T675 LS T776, LA T776, LO T776, LY T776, LB T776 LHGB T686 LT T68C, LB T68C - Hyper Mini TOPLED® LB M676 - Mini TOPLED Santana® LG M470 LS M47K, LO M47K, LY M47K Source: http://www.osram.convergy.de LUXEON: - LUMILED® LXK2-PW12-R00, LXK2-PW12-S00, LXK2-PW14-U00, LXK2-PW14-V00 LXK2-PM12-R00, LXK2-PM12-S00, LXK2-PM14-U00 LXK2-PE12-Q00, LXK2-PE12-R00, LXK2-PE12-S00, LXK2-PE14-T00, LXK2-PE14-U00 LXK2-PB12-K00, LXK2-PB12-L00, LXK2-PB12-M00, LXK2-PB14-N00, LXK2-PB14-P00, LXK2-PB14-Q00 LXK2-PR12-L00, LXK2-PR12-M00, LXK2-PR14-Q00, LXK2-PR14-R00 LXK2-PD12-Q00, LXK2-PD12-R00, LXK2-PD12-S00 LXK2-PH12-R00, LXK2-PH12-S00 LXK2-PL12-P00, LXK2-PL12-Q00, LXK2-PL12-R00 Source: www.luxeon.com KINGBRIGHT: KA-3528ASYC Source: www.kingbright.com
MAX = MAX395:MAX395CWG+; MANUFACTURER_PART_NUMBER: MAX395CWG+; VENDOR: Maxim Integrated Products
Q1 = crystal:CRYSTAL: CRYSTAL; OC_FARNELL: 1667008; OC_NEWARK: unknown
Q2 = transistor-pnp:BC557*: PNP Transistror
R1-R13 R106 R110 R111 R113 R118-R122 R132 R133 = resistor:R-US_: RESISTOR, American symbol
R14-R105 R107-R109 R112 R114-R117 R123-R131 R134 R135 = rcl:R-US_: RESISTOR, American symbol; SPICEPREFIX: R
S2 = switch-omron:10-XX: OMRON SWITCH; MPN: B3F-1000; OC_FARNELL: 176432; OC_NEWARK: 36M3542
SV1 = con-lstb:MA07-2: PIN HEADER; OC_FARNELL: unknown; OC_NEWARK: unknown
T1 T2 = transistor-neu-to92:BC547: NPN TRANSISTOR
TPS7333 = Texas Instruments_By_element14_Batch_1:TPS7333QD: LOW-DROPOUT VOLTAGE REGULATORS; MPN: TPS7333QD; OC_FARNELL: -; OC_NEWARK: 52F2803; PACKAGE: SOIC-8; SUPPLIER: Texas Instruments
VDD VSS = pinhead:PINHD-1X2: PIN HEADER
VREF1-VREF4 = ref2030:REF2030AIDDCR
VREG+5 = linear:78*: Positive VOLTAGE REGULATOR Source: http://cache.national.com/ds/LM/LM78L05.pdf http://www.fairchildsemi.com/ds/LM/LM7805.pdf
VREG-5 = linear:79*: Negative VOLTAGE REGULATOR

## Net classes
0 default: width 0.203 mm
1 power: width 0.254 mm